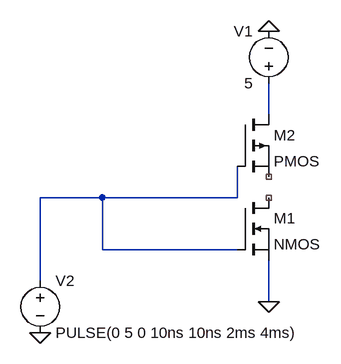
[diagram p0: schematic Draft4.asc]
Draft4.asc, the LTspice schematic file:
Version 4
SHEET 1 880 680
WIRE 336 112 336 64
WIRE 80 240 -16 240
WIRE 288 240 288 192
WIRE 288 240 80 240
WIRE 80 320 80 240
WIRE 288 320 80 320
WIRE -16 368 -16 240
WIRE 336 400 336 336
FLAG 336 -16 0
FLAG -16 448 0
FLAG 336 400 0
SYMBOL voltage 336 80 R180
WINDOW 0 24 96 Left 2
WINDOW 3 24 16 Left 2
WINDOW 123 0 0 Left 0
WINDOW 39 0 0 Left 0
SYMATTR InstName V1
SYMATTR Value 5
SYMBOL voltage -16 352 R0
WINDOW 123 0 0 Left 0
WINDOW 39 0 0 Left 0
SYMATTR InstName V2
SYMATTR Value PULSE(0 5 0 10ns 10ns 2ms 4ms)
SYMBOL nmos 288 240 R0
SYMATTR InstName M1
SYMBOL pmos 288 112 R0
SYMATTR InstName M2

The netlist it stands for:
* Draft4.asc
V1 N001 0 5
V2 N002 0 PULSE(0 5 0 10ns 10ns 2ms 4ms)
M1 NC_01 N002 0 0 NMOS
M2 N001 N002 NC_02 NC_02 PMOS
.model NMOS NMOS
.model PMOS PMOS
.lib standard.mos
.backanno
.end